# EAGLE schematic orblink (EAGLE 6.4)
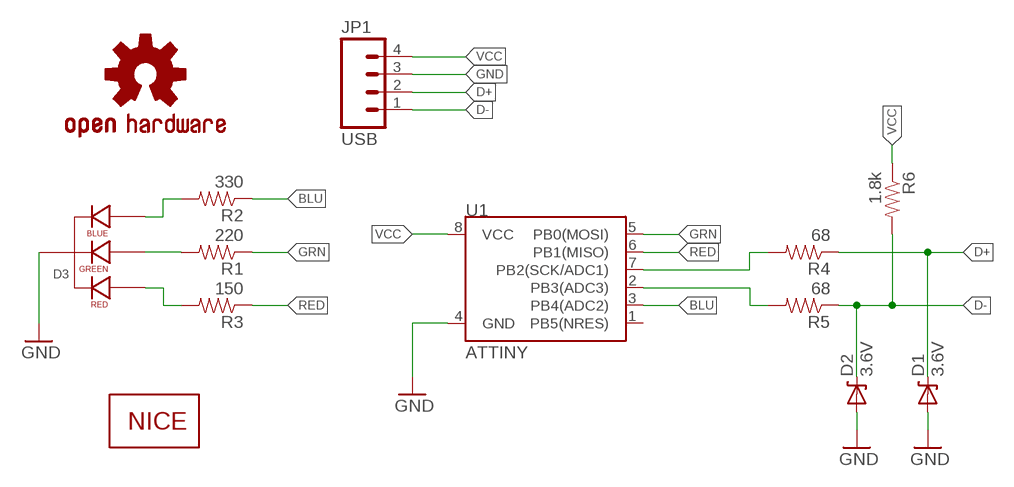
[diagram p0: schematic, sheet 1]

## Parts
D1  3.6V  DIODE-ZENERPTH  [DIODE-ZENER]
D2  3.6V  DIODE-ZENERPTH  [DIODE-ZENER]
D3  LED-RGB-CC-THRUDIFFUSE  [LED-RGB-THRU]
JP1  USB  M04PTH  [1X04]
LOGO1  OSHW-LOGOS  [OSHW-LOGO-S]
R1  220  RESISTORPTH-1/6W  [1/6W-RES]
R2  330  RESISTORPTH-1/6W  [1/6W-RES]
R3  150  RESISTORPTH-1/6W  [1/6W-RES]
R4  68  RESISTORPTH-1/6W  [1/6W-RES]
R5  68  RESISTORPTH-1/6W  [1/6W-RES]
R6  1.8k  RESISTORPTH-1/6W  [1/6W-RES]
U1  ATTINY  ATTINY45TINY85-20-DIP  [DIP08]
U$1  NICE-LOGO04  [NICE-LOGO-04]

## Nets
BLU: R2.1 U1.3(PB4(ADC2))
D+: D1.P$1(C) JP1.2 R4.1
D-: D2.P$1(C) JP1.1 R5.1 R6.2
GND: D1.P$2(A) D2.P$2(A) D3.2(CATHODE) JP1.3 U1.4(GND)
GRN: R1.1 U1.5(PB0(MOSI))
N$1: D3.4(BLUE_CATHODE) R2.2
N$2: D3.3(GREEN_CATHODE) R1.2
N$3: R4.2 U1.7(PB2(SCK/ADC1))
N$4: R5.2 U1.2(PB3(ADC3))
N$5: D3.1(RED_CATHODE) R3.2
RED: R3.1 U1.6(PB1(MISO))
VCC: JP1.4 R6.1 U1.8(VCC)
Unconnected: U1.1(PB5(NRES))

## Library data of the parts
D1 D2 = SparkFun-DiscreteSemi:DIODE-ZENER: Zener Diode Production Part - 8199 3.4V Zener Voltage
D3 = SparkFun-LED:LED-RGB-CC-THRU: RGB Through-hole common cathode LED SparkFun Storefront: COM-00105 (Clear) COM-09264 (Diffuse); PROD_ID: DIO-09434
JP1 = SparkFun-Connectors:M04: Header 4 Standard 4-pin 0.1" header. Use with straight break away headers (SKU : PRT-00116), right angle break away headers (PRT-00553), swiss pins (PRT-00743), machine pins (PRT-00117), and female headers (PRT-00115). Molex polarized connector foot print use with SKU : PRT-08231 with associated crimp pins and housings. 1MM SMD Version SKU: PRT-10208
LOGO1 = SparkFun-Aesthetics:OSHW-LOGO: Open Source Hardware Logo This logo indicates the piece of hardware it is found on incorporates a OSHW license and/or adheres to the definition of open source hardware found here: http://freedomdefined.org/OSHW
R1-R6 = SparkFun-Resistors:RESISTOR: Resistor Basic schematic elements and footprints for 0603, 1206, and PTH resistors.
U1 = SparkFun-DigitalIC:ATTINY45: Atmel 8-pin 2/4/8kB flash uC; PROD_ID: IC-09445; VALUE: TINY85-20-DIP
U$1 = 0_hads:NICE-LOGO